# Altium schematic sheet imu.SchDoc
size A
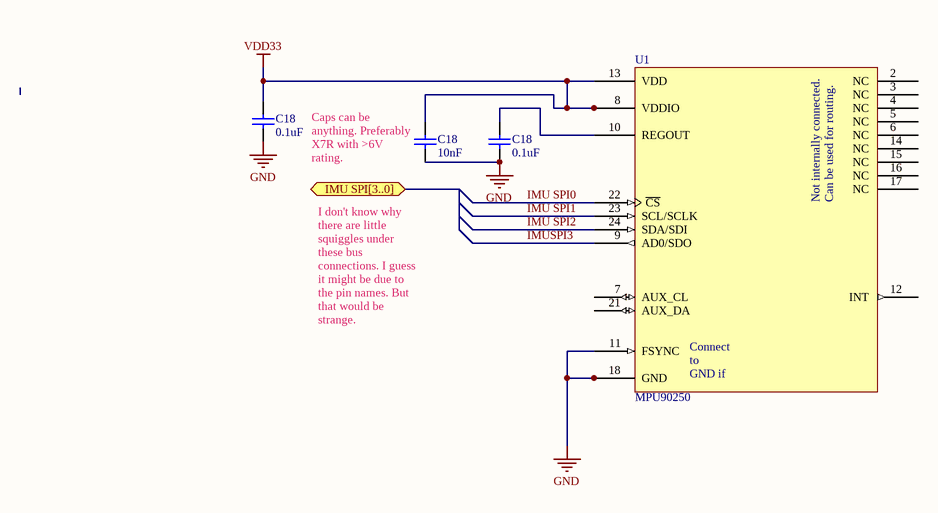
[diagram p0: imu.SchDoc]

## Parts
(Parts that share a designator on the sheet are numbered #1, #2 ... from top to bottom, then left to right.)
C18#1  value 0.1uF  [RAD-0.3]  (hidden comment: Cap)
C18#2  value 10nF  [RAD-0.3]  (hidden comment: Cap)
C18#3  value 0.1uF  [RAD-0.3]  (hidden comment: Cap)
U1  MPU90250  [QFN24-3x3mm]

## Ports
IMU SPI[3..0] (bidir)

## Nets
GND: C18#1.2 C18#2.2 C18#3.2 U1.11(FSYNC) U1.18(GND) U1.20(RESV)
VDD33: C18#1.1 C18#2.1 U1.1(RESV) U1.8(VDDIO) U1.13(VDD)
IMU SPI0: U1.22(~{CS})
IMU SPI1: U1.23(SCL/SCLK)
IMU SPI2: U1.24(SDA/SDI)
IMUSPI3: U1.9(AD0/SDO)
NetC18#3_1: C18#3.1 U1.10(REGOUT)

Not connected (* = marked no-connect by the designer): U1 2(NC) 3(NC) 4(NC) 5(NC) 6(NC) 7(AUX_CL) 12(INT) 14(NC) 15(NC) 16(NC) 17(NC) 19(DO_NOT_CONNECT) 21(AUX_DA)

## Notes on the sheet
- (near C18#2) Caps can be anything. Preferably X7R with >6V rating.
- I don't know why there are little squiggles under these bus connections. I guess it might be due to the pin names. But that would be strange.
- (in symbol MPU90250) Not internally connected.; Can be used for routing.; Connect to / GND if / not in use

## Library data of the parts
C18#1-C18#3 = Cap: Capacitor; Published: 8-Jun-2000; LatestRevisionDate: 17-Jul-2002; LatestRevisionNote: Re-released for DXP Platform.; PackageReference: RAD-0.3; Publisher: Altium Limited; PackageDescription: Radial Cap, Thru-Hole; 2 Leads; 0.3 in Pin Spacing
U1 = MPU90250: 9-Axis IMU (Accel, Gyro, Magno)